# EAGLE schematic tm9_module (EAGLE 9.6.2)
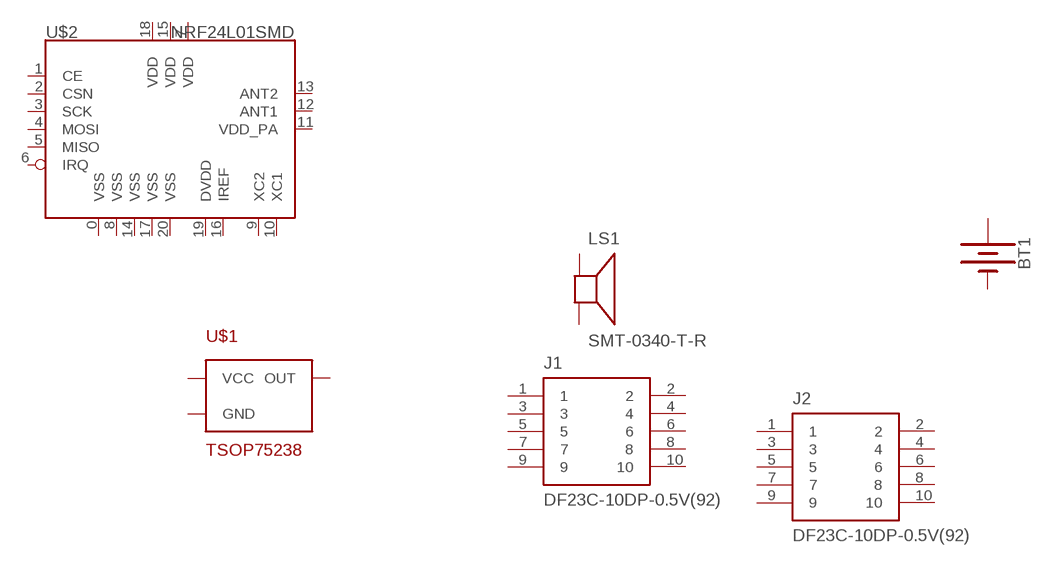
[diagram p0: schematic, sheet 1]

## Parts
BT1  BATTERY-20MM_SMD_4LEGS_OVERPASTE_INNER  [BATTCON_20MM_4LEGS_OVERPASTE_INNER]
J1  DF23C-10DP-0.5V(92)  [HIROSE_DF23C-10DP-0.5V(92)]
J2  DF23C-10DP-0.5V(92)  [HIROSE_DF23C-10DP-0.5V(92)]
LS1  SMT-0340-T-R  [XDCR_SMT-0340-T-R]
U$1  TSOP75238  [TSOP75238]
U$2  NRF24L01SMD  [QFN20-4X4MM]
Unconnected: J1.1 J1.2 J1.3 J1.4 J1.5 J1.6 J1.7 J1.8 J1.9 J1.10 J2.1 J2.2 J2.3 J2.4 J2.5 J2.6 J2.7 J2.8 J2.9 J2.10 LS1.N LS1.P U$1.P$1(GND) U$1.P$2(VCC) U$1.P$3(OUT) U$1.P$4(GND) U$2.1(CE) U$2.2(CSN) U$2.3(SCK) U$2.4(MOSI) U$2.5(MISO) U$2.6(IRQ) U$2.9(XC2) U$2.10(XC1) U$2.12(ANT1) U$2.13(ANT2) U$2.16(IREF)

## Power pins joined to a net without a drawn wire
+: BT1.1(+)
-: BT1.2(-)
DVDD: U$2.19(DVDD)
VDD: U$2.7(VDD) U$2.15(VDD) U$2.18(VDD)
VDD_PA: U$2.11(VDD_PA)
VSS: U$2.0(VSS) U$2.8(VSS) U$2.14(VSS) U$2.17(VSS) U$2.20(VSS)

## Library data of the parts
BT1 = SparkFun-Batteries:BATTERY: Battery - Single Cell A variety of battery chemistries, sizes, and footprints. Device List: 20MM_PTH - Coin Cell Battery Holder - 20mm (PTH) <https://www.sparkfun.com/products/783> 20MM_PTH_KIT- Coin Cell battery Holder - 20 mm (PTH) <http://www.sparkfun.com/products/783>kit version with special mask 6.8MM_PTH - Coin Cell Battery Holder - 6.8MM(SMD) <https://www.digikey.com/product-detail/en/seiko-instruments/MS621FE-FL11E/728-1057-ND/1889208?WT.srch=1&gclid=CNOQ5a6LzdQCFZS2wAodXCkE0g> 12MM_SMD - Coin Cell Battery Holder - 12mm (SMD) <https://www.sparkfun.com/products/10592> 12MM_PTH - Coin Cell Battery Holder - 12mm (PTH) <https://www.sparkfun.com/products/7948> 20MM_SMD - 20mm Coin Cell Battery Holder (SMD) (2 legs) Used on the Big Time Watch Kit <https://www.sparkfun.com/products/11734> 20MM_SMD_4LEGS - Coin Cell Battery Holder - 20mm (SMD) <https://www.sparkfun.com/products/11892> 20MM_SMD_4LEGS_OVERPASTE - Coin Cell Battery Holder - 20mm (SMD) <https://www.sparkfun.com/products/11892> (Over-paste on the legs) 24.5MM_PTH - Coin Cell Battery Holder - 24.5mm (PTH) <https://www.sparkfun.com/products/8863> 9V - 9V Battery Holder - PC Mount Used on the SparkFun SparkPunk Sound Kit <https://www.sparkfun.com/products/11177> and SparkFun SparkPunk Sequencer Kit <https://www.sparkfun.com/products/12707> 18650 - Battery Holder - 18650 (PTH) <https://www.sparkfun.com/products/13113> AA - Battery Holder - 1xAA (PTH) <https://www.sparkfun.com/products/7949> AAA - Battery Holder - 1xAAA (PTH) <https://www.sparkfun.com/products/12718> AA_KIT - Battery Holder - 1xAA (PTH) <https://www.sparkfun.com/products/7949> Special kit package - pads only have exposed copper on one side of the board. AAA_KIT - Battery Holder - 1xAAA (PTH) <https://www.sparkfun.com/products/12718> Special kit package - pads only have exposed copper on one side of the board.
J1 J2 = DF23C-10DP-0.5V_92_:DF23C-10DP-0.5V(92): 10 Position Connector Plug, Outer Shroud Contacts Surface Mount Gold; MANUFACTURER: Hirose; MAXIMUM_PACKAGE_HEIGHT: 1.3 mm; PARTREV: N/A; STANDARD: Manufacturer Recommendations
LS1 = SMT-0340-T-R:SMT-0340-T-R; MANUFACTURER: Pui Audio; MAXIMUM_PACKAGE_HEIGHT: 2.00 mm; PARTREV: 3/10/2020; STANDARD: Manufacturer Recomemndations
U$1 = TSOP75238:TSOP75238: Check availability <https://pricing.snapeda.com/parts/TSOP75238/Vishay/view-part?ref=eda>; AVAILABILITY: In Stock; DESCRIPTION: IR Remote Receiver 38kHz 100° 24m 4-Pin Mini-SMD T/R; MF: Vishay; MP: TSOP75238; PACKAGE: None; PRICE: None; PURCHASE-URL: https://pricing.snapeda.com/search/part/TSOP75238/?ref=eda
U$2 = SparkFun-RF:NRF24L01: Nordic nrf24L01 2.4GHz Low-power Transceiver This is the very popular, low cost, very low power RF transceiver from Nordic Semiconductor. Simple SPI interface. SparkFun Products 2.4GHz Transceiver IC - nRF24L01+ <https://www.sparkfun.com/products/690> (COM-00690) SparkFun Transceiver Breakout - nRF24L01+ (RP-SMA) <https://www.sparkfun.com/products/705> (WRL-00705) SparkFun Transceiver Breakout - nRF24L01+ <https://www.sparkfun.com/products/691> (COM-00691); PROD_ID: IC-08950; SF_ID: COM-00690